# Altium schematic sheet JK_FF.SchDoc
size A4
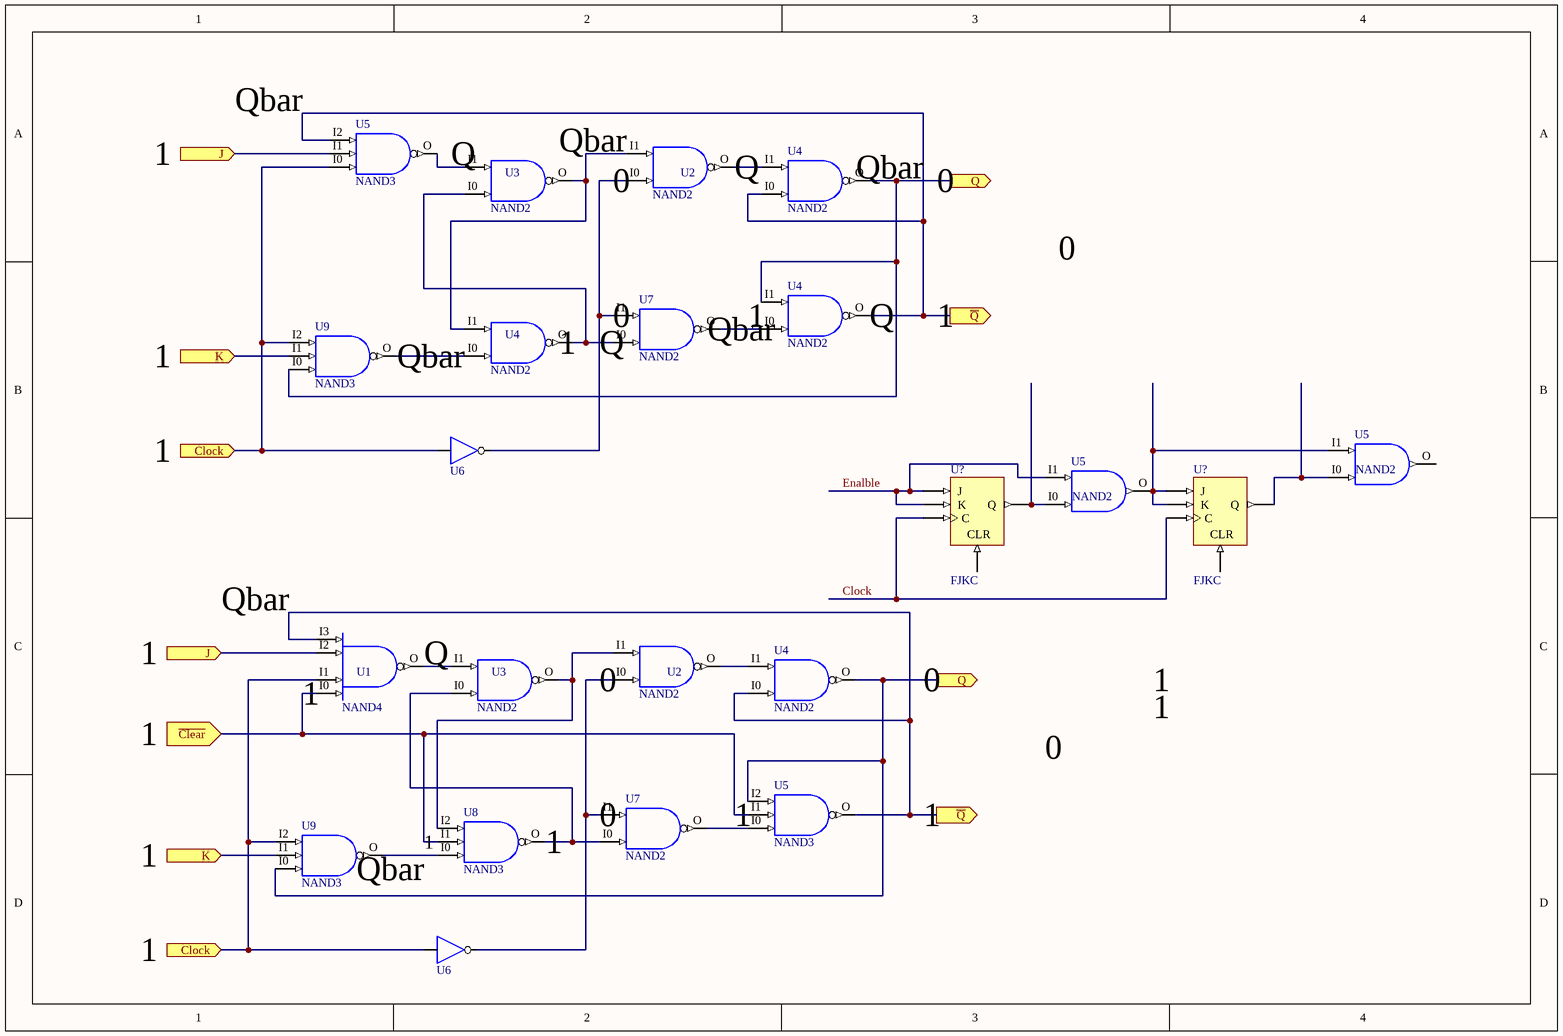
[diagram p0: JK_FF.SchDoc]

## Parts
(Parts that share a designator on the sheet are numbered #1, #2 ... from top to bottom, then left to right.)
U1  NAND4
U2#1  NAND2
U2#2  NAND2
U3#1  NAND2
U3#2  NAND2
U4#1  NAND2
U4#2  NAND2
U4#3  NAND2
U4#4  NAND2
U5#1  NAND3
U5#2  NAND2
U5#3  NAND2
U5#4  NAND3
U6#1  not  (value not drawn)
U6#2  not  (value not drawn)
U7#1  NAND2
U7#2  NAND2
U8  NAND3
U9#1  NAND3
U9#2  NAND3
U?#1  FJKC
U?#2  FJKC

## Ports
Clock (in), J (in), K (in), Q (out), ~{Clear} (in), ~{Q} (out)

## Nets
~{Clear}: U1.I0 U5#4.I1 U8.I1 ; port ~{Clear}
Clock: U1.I1 U5#1.I0 U6#1.i U6#2.i U9#1.I2 U9#2.I2 ; port Clock
Clock: U?#1.C U?#2.C  [a separate net that carries the same name]
Enalble: U5#3.I1 U?#1.J U?#1.K
J: U1.I2 U5#1.I1 ; port J
K: U9#1.I1 U9#2.I1 ; port K
Q: U4#1.O U4#2.I1 U4#4.O U5#4.I2 U9#1.I0 U9#2.I0 ; port Q
~{Q}: U1.I3 U4#1.I0 U4#2.O U4#4.I0 U5#1.I2 U5#4.O ; port ~{Q}
NetU1_O: U1.O U3#2.I1
NetU2#1_I0: U2#1.I0 U6#1.o U7#1.I1
NetU2#1_I1: U2#1.I1 U3#1.O U4#3.I1
NetU2#1_O: U2#1.O U4#1.I1
NetU2#2_I0: U2#2.I0 U6#2.o U7#2.I1
NetU2#2_I1: U2#2.I1 U3#2.O U8.I2
NetU2#2_O: U2#2.O U4#4.I1
NetU3#1_I0: U3#1.I0 U4#3.O U7#1.I0
NetU3#1_I1: U3#1.I1 U5#1.O
NetU3#2_I0: U3#2.I0 U7#2.I0 U8.O
NetU4#2_I0: U4#2.I0 U7#1.O
NetU4#3_I0: U4#3.I0 U9#1.O
NetU5#2_I0: U5#2.I0 U?#2.Q
NetU5#2_I1: U5#2.I1 U5#3.O U?#2.J U?#2.K
NetU5#3_I0: U5#3.I0 U?#1.Q
NetU5#4_I0: U5#4.I0 U7#2.O
NetU8_I0: U8.I0 U9#2.O

Not connected (* = marked no-connect by the designer): U5#2 O; U?#1 CLR; U?#2 CLR

## Notes on the sheet
- Qbar
- 1
- (near U3#1) Q
- (near U2#1) 0
- Q
- (near U4#1) Qbar
- 0
- (near U7#1) 0
- (near U4#2) 1
- (near U4#2) Q
- (near U4#3) 1
- (near U7#1) Q
- (near U1) 1
- (near U2#2) 0
- (near U8) 1
- (near U7#2) 0
- (near U5#4) 1
- (near U9#2) Qbar

## Library data of the parts
U1 = NAND4: 4-Input NAND Gate; FPGAVendor: CUPL; Published: 17-Apr-2002; Publisher: Altium Limited
U2#1 U2#2 U3#1 U3#2 U4#1-U4#4 U5#2 U5#3 U7#1 U7#2 = NAND2: 2-Input NAND Gate; FPGAVendor: CUPL; Published: 17-Apr-2002; Publisher: Altium Limited
U5#1 U5#4 U8 U9#1 U9#2 = NAND3: 3-Input NAND Gate; FPGAVendor: CUPL; Published: 17-Apr-2002; Publisher: Altium Limited
U6#1 U6#2 = BUF: 1-bit General Purpose (Non-inverting) Buffer
U?#1 U?#2 = FJKC: J-K Flip-Flop with Asynchronous Clear; FPGAVendor: CUPL; Published: 17/04/2002 5:24:18 PM; DatasheetDocument: 1999; Publisher: Altium Limited